# Altium schematic sheet ADCMultiplexerFrontEnd.SchDoc: XADC Multiplexer Front-End
size A3; SheetNumber: 1; SheetTotal: 1
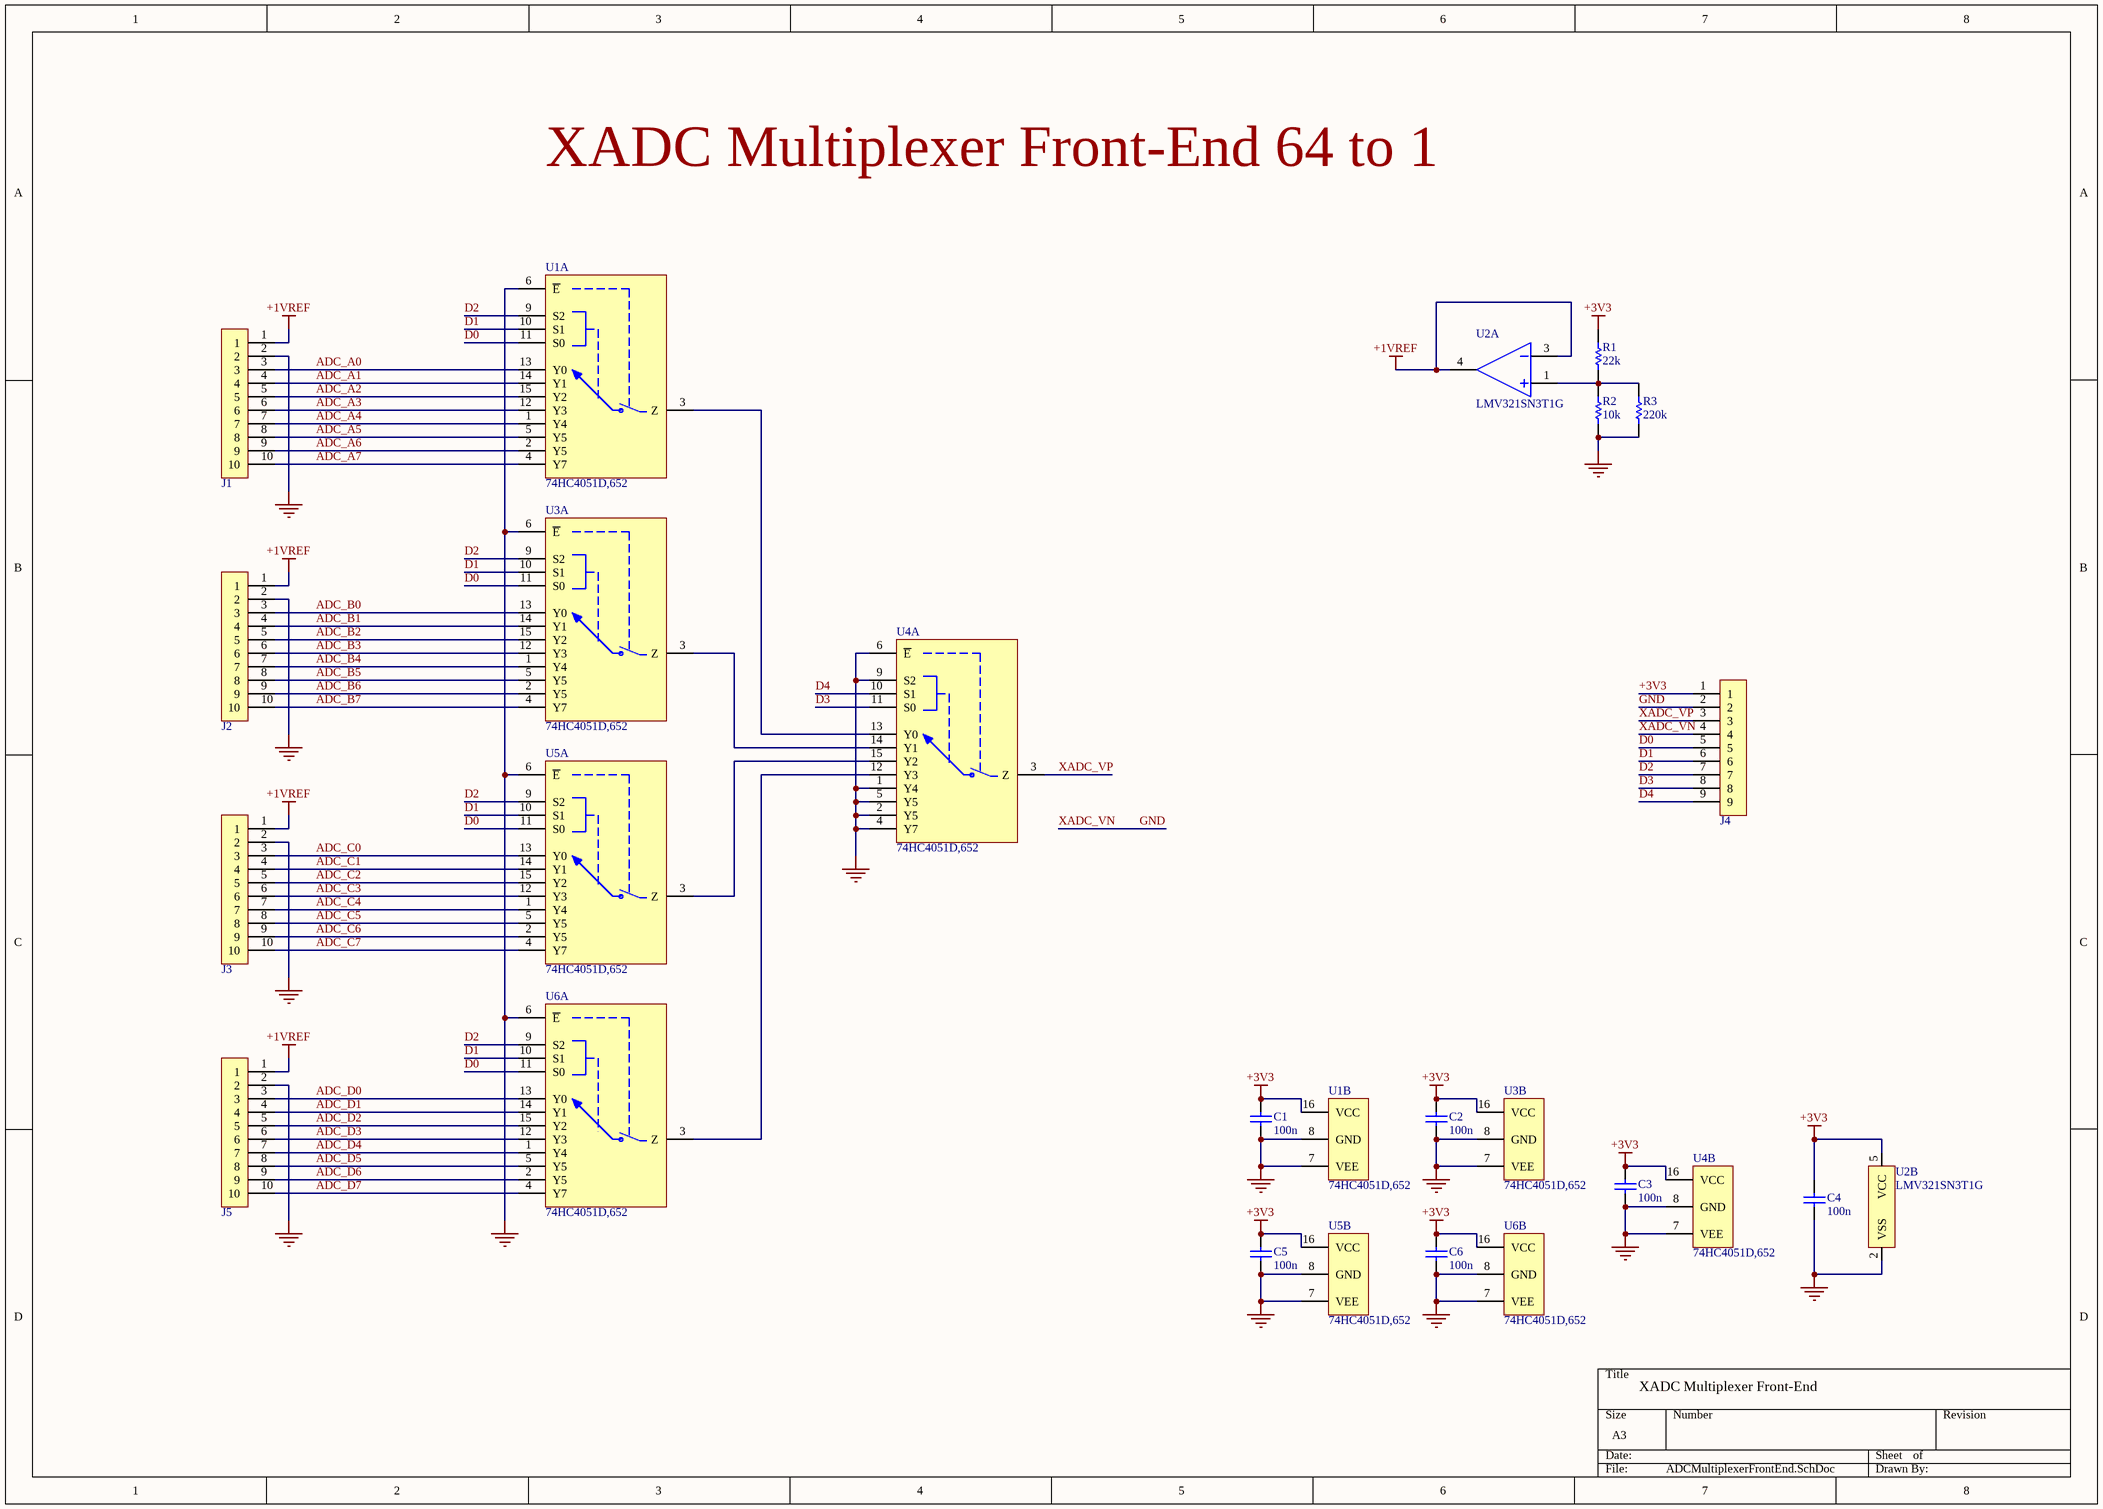
[diagram p0: ADCMultiplexerFrontEnd.SchDoc]

## Parts
C1  100n  [C0603]
C2  100n  [C0603]
C3  100n  [C0603]
C4  100n  [C0603]
C5  100n  [C0603]
C6  100n  [C0603]
J1  HDR M 1x8 2.54MM  [HDR M 1x10 2.54MM]  (value not drawn)
J2  HDR M 1x8 2.54MM  [HDR M 1x10 2.54MM]  (value not drawn)
J3  HDR M 1x8 2.54MM  [HDR M 1x10 2.54MM]  (value not drawn)
J4  HDR M 1x8 2.54MM  [HDR M 1x9 2.54MM]  (value not drawn)
J5  HDR M 1x8 2.54MM  [HDR M 1x10 2.54MM]  (value not drawn)
R1  22k  [R0805]
R2  10k  [R0805]
R3  220k  [R0805]
U1  74HC4051D,652  [SOIC16]  (parts A,B of 2)
U2  LMV321SN3T1G  [TSOP5]  (parts A,B of 2)
U3  74HC4051D,652  [SOIC16]  (parts A,B of 2)
U4  74HC4051D,652  [SOIC16]  (parts A,B of 2)
U5  74HC4051D,652  [SOIC16]  (parts A,B of 2)
U6  74HC4051D,652  [SOIC16]  (parts A,B of 2)

## Nets
+1VREF: J1.1 J2.1 J3.1 J5.1 U2.3 U2.4
+3V3: C1.2 C2.2 C3.2 C4.2 C5.2 C6.2 J4.1 R1.2 U1.16(VCC) U2.5(VCC) U3.16(VCC) U4.16(VCC) U5.16(VCC) U6.16(VCC)
GND: C1.1 C2.1 C3.1 C4.1 C5.1 C6.1 J1.2 J2.2 J3.2 J4.2 J4.4 J5.2 R2.1 R3.1 U1.6(~{E}) U1.7(VEE) U1.8(GND) U2.2(VSS) U3.6(~{E}) U3.7(VEE) U3.8(GND) U4.1(Y4) U4.2(Y5) U4.4(Y7) U4.5(Y5) U4.6(~{E}) U4.7(VEE) U4.8(GND) U4.9(S2) U5.6(~{E}) U5.7(VEE) U5.8(GND) U6.6(~{E}) U6.7(VEE) U6.8(GND)  [also labelled XADC_VN]
ADC_A0: J1.3 U1.13(Y0)
ADC_A1: J1.4 U1.14(Y1)
ADC_A2: J1.5 U1.15(Y2)
ADC_A3: J1.6 U1.12(Y3)
ADC_A4: J1.7 U1.1(Y4)
ADC_A5: J1.8 U1.5(Y5)
ADC_A6: J1.9 U1.2(Y5)
ADC_A7: J1.10 U1.4(Y7)
ADC_B0: J2.3 U3.13(Y0)
ADC_B1: J2.4 U3.14(Y1)
ADC_B2: J2.5 U3.15(Y2)
ADC_B3: J2.6 U3.12(Y3)
ADC_B4: J2.7 U3.1(Y4)
ADC_B5: J2.8 U3.5(Y5)
ADC_B6: J2.9 U3.2(Y5)
ADC_B7: J2.10 U3.4(Y7)
ADC_C0: J3.3 U5.13(Y0)
ADC_C1: J3.4 U5.14(Y1)
ADC_C2: J3.5 U5.15(Y2)
ADC_C3: J3.6 U5.12(Y3)
ADC_C4: J3.7 U5.1(Y4)
ADC_C5: J3.8 U5.5(Y5)
ADC_C6: J3.9 U5.2(Y5)
ADC_C7: J3.10 U5.4(Y7)
ADC_D0: J5.3 U6.13(Y0)
ADC_D1: J5.4 U6.14(Y1)
ADC_D2: J5.5 U6.15(Y2)
ADC_D3: J5.6 U6.12(Y3)
ADC_D4: J5.7 U6.1(Y4)
ADC_D5: J5.8 U6.5(Y5)
ADC_D6: J5.9 U6.2(Y5)
ADC_D7: J5.10 U6.4(Y7)
D0: J4.5 U1.11(S0) U3.11(S0) U5.11(S0) U6.11(S0)
D1: J4.6 U1.10(S1) U3.10(S1) U5.10(S1) U6.10(S1)
D2: J4.7 U1.9(S2) U3.9(S2) U5.9(S2) U6.9(S2)
D3: J4.8 U4.11(S0)
D4: J4.9 U4.10(S1)
XADC_VP: J4.3 U4.3(Z)
NetR1_1: R1.1 R2.2 R3.2 U2.1
NetU1_3: U1.3(Z) U4.13(Y0)
NetU3_3: U3.3(Z) U4.14(Y1)
NetU4_12: U4.12(Y3) U6.3(Z)
NetU4_15: U4.15(Y2) U5.3(Z)

## Notes on the sheet
- XADC Multiplexer Front-End 64 to 1

## Library data of the parts
C1-C6 = C0603KC0G100V104
J1-J3 J5 = HDR M 1x10 2.54MM
J4 = HDR M 1x9 2.54MM
R1 = R0805F22K
R2 = R0805F10K
R3 = R0805F220K
U1 U3-U6 = 74HC4051D,652: IC MUX/DEMUX 8X1 16SOIC; Manufacturer: Nexperia; Supplier 1: RSComponents; Manufacturer Part Number: 74HC4051D,652; RoHS: Yes; Category: Decoders and Multiplexers; Stock 1: 155; Pricing 1: 1=0.52000, 70=0.49300, 100=0.47900, 250=0.43800, 500=0.42400 (USD); RoHS Compliant: Yes; ComponentLink1URL: https://assets.nexperia.com/documents/data-sheet/74HC_HCT4051.pdf?src-supplier=Digi-Key; ComponentLink1Description: https://assets.nexperia.com/documents/data-sheet/74HC_HCT4051.pdf?src-supplier=Digi-Key; Supplier Part Number 1: 1697756
U2 = LMV321SN3T1G: ON SEMICONDUCTOR - LMV321SN3T1G - OP-AMP, SINGLE, 1MHZ, 1V/US, TSOP-5; Operating Supply Voltage: 3V; Min Supply Voltage: 2.7V; Max Supply Voltage: 5V; Common Mode Rejection Ratio: 50dB; Number of Channels: 1; Output Current: 160mA; Nominal Supply Current: 250uA; Voltage Gain: 100dB; Slew Rate: 1V/µs; Input Bias Current: 1nA; Input Offset Voltage (Vos): 9mV; Operating Supply Current: 130uA; Amplifier Type: GENERAL PURPOSE; Supplier 1: RSComponents; Manufacturer: ON Semiconductor; Manufacturer Part Number: LMV321SN3T1G; RoHS: Yes; Category: Amplifiers - Op Amps, Buffer, Instrumentation; Stock 1: 3580; Pricing 1: 20=0.11000, 100=0.21500, 1000=0.15900, 3000=0.14200, 9000=0.14000 (USD); Case/Package: TSOP; Number of Pins: 5; Contact Plating: Tin,Matte; Min Operating Temperature: -40°C; Max Operating Temperature: 85°C; Packaging: Tape and Reel; Unity Gain Bandwidth Product: 1MHz; Package Quantity: 3000; Nominal Gain Bandwidth Product: 1MHz; Number of Circuits: 1; Gain Bandwidth Product: 1MHz; Output Current per Channel: 160mA; Number of Elements: 1; Power Supply Rejection Ratio (PSRR): 50dB; Supply Current: 250uA; Series: -; Technology: CMOS; Input Offset Voltage-Max: 9mV; Slew Rate-Nom: 1V/µs; Length: 3mm; Width: 1.5mm; Height: 1mm; Radiation Hardening: No; Lead Free: Lead Free; Halogen Free: Halogen Free; RoHS Compliant: Yes; ComponentLink1URL: https://datasheet.ciiva.com/30481/0900766b81267f93-30481486.pdf?src-supplier=RSComponents; ComponentLink1Description: https://datasheet.ciiva.com/30481/0900766b81267f93-30481486.pdf?src-supplier=RSComponents; ComponentLink2URL: https://datasheet.ciiva.com/6627/lmv321-lmv358-lmv324-d-6627357.pdf?src-supplier=Digi-Key; ComponentLink2Description: https://datasheet.ciiva.com/6627/lmv321-lmv358-lmv324-d-6627357.pdf?src-supplier=Digi-Key; ComponentLink3URL: https://datasheet.ciiva.com/11710/lmv321-lmv358-lmv324-d-11710749.pdf?src-supplier=Avnet; ComponentLink3Description: https://datasheet.ciiva.com/11710/lmv321-lmv358-lmv324-d-11710749.pdf?src-supplier=Avnet; ComponentLink4URL: https://datasheet.ciiva.com/16456/lmv321-lmv358-lmv324-d-16456749.pdf?src-supplier=Future+Electronics; ComponentLink4Description: https://datasheet.ciiva.com/16456/lmv321-lmv358-lmv324-d-16456749.pdf?src-supplier=Future+Electronics; ComponentLink5URL: https://datasheet.ciiva.com/6627/lmv321-lmv358-lmv324-d-6627359.pdf?src-supplier=Digi-Key; ComponentLink5Description: https://datasheet.ciiva.com/6627/lmv321-lmv358-lmv324-d-6627359.pdf?src-supplier=Digi-Key; Supplier Part Number 1: 7878661